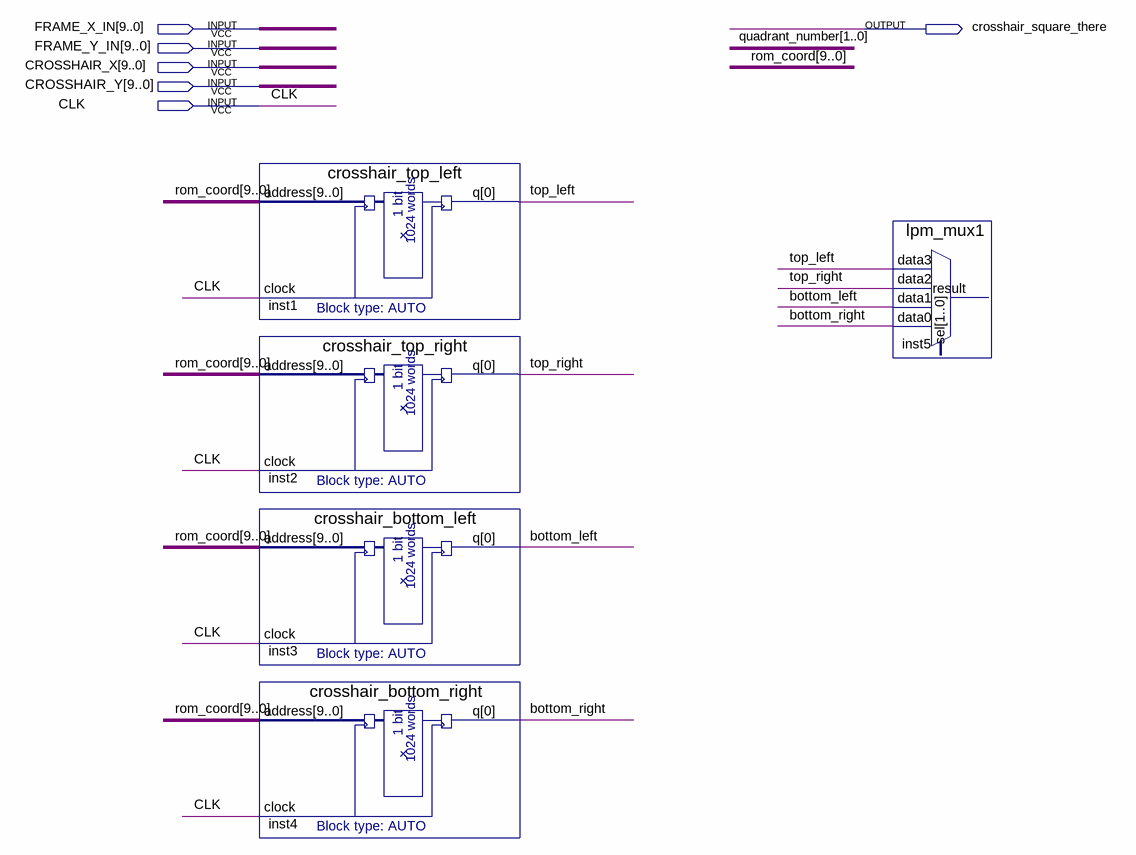
[diagram p0: schematic sheet]
// Quartus schematic crosshair_display.bdf as structural Verilog: 5 symbols, 6 pins
module crosshair_display (
  input  [9:0] FRAME_X_IN,
  input  [9:0] FRAME_Y_IN,
  input  [9:0] CROSSHAIR_X,
  input  [9:0] CROSSHAIR_Y,
  input  CLK,
  output crosshair_square_there
);

  wire bottom_left, bottom_right, top_left, top_right;
  wire [9:0] rom_coord;

  crosshair_top_left inst1 (.address(rom_coord), .clock(CLK), .q(top_left));
  crosshair_top_right inst2 (.address(rom_coord), .clock(CLK), .q(top_right));
  crosshair_bottom_left inst3 (.address(rom_coord), .clock(CLK), .q(bottom_left));
  crosshair_bottom_right inst4 (.address(rom_coord), .clock(CLK), .q(bottom_right));
  lpm_mux1 inst5 (.data3(top_left), .data2(top_right), .data1(bottom_left), .data0(bottom_right));  // open: sel, result
endmodule
